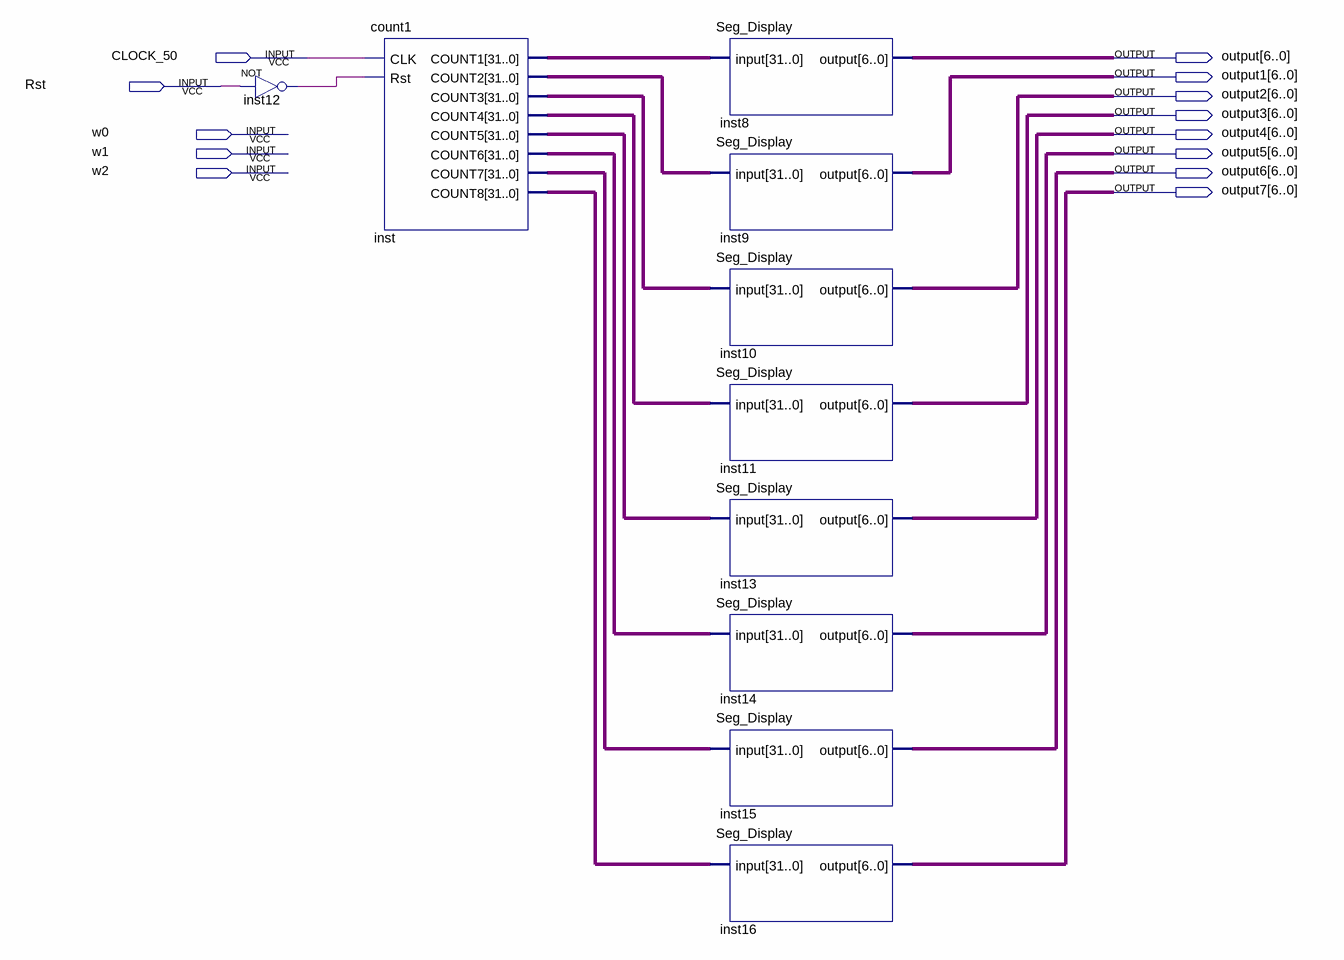
[diagram p0: schematic sheet]
// Quartus schematic Block1.bdf as structural Verilog: 10 symbols, 13 pins
module Block1 (
  input  CLOCK_50,
  input  Rst,
  input  w0,
  input  w1,
  input  w2,
  output [6:0] \output ,
  output [6:0] output1,
  output [6:0] output2,
  output [6:0] output3,
  output [6:0] output4,
  output [6:0] output5,
  output [6:0] output6,
  output [6:0] output7
);

  wire inst12_out;
  wire [31:0] inst_count1, inst_count2, inst_count3, inst_count4, inst_count5, inst_count6, inst_count7,
       inst_count8;

  not inst12 (inst12_out, Rst);
  count1 inst (
    .CLK(CLOCK_50), .Rst(inst12_out), .COUNT1(inst_count1), .COUNT2(inst_count2), .COUNT3(inst_count3),
    .COUNT4(inst_count4), .COUNT5(inst_count5), .COUNT6(inst_count6), .COUNT7(inst_count7),
    .COUNT8(inst_count8));
  Seg_Display inst8 (.\input (inst_count1), .\output (\output ));
  Seg_Display inst9 (.\input (inst_count2), .\output (output1));
  Seg_Display inst10 (.\input (inst_count3), .\output (output2));
  Seg_Display inst11 (.\input (inst_count4), .\output (output3));
  Seg_Display inst13 (.\input (inst_count5), .\output (output4));
  Seg_Display inst14 (.\input (inst_count6), .\output (output5));
  Seg_Display inst15 (.\input (inst_count7), .\output (output6));
  Seg_Display inst16 (.\input (inst_count8), .\output (output7));
endmodule
